# Altium schematic sheet Ethernet.SchDoc
size A4; SheetNumber: 7; SheetTotal: 12
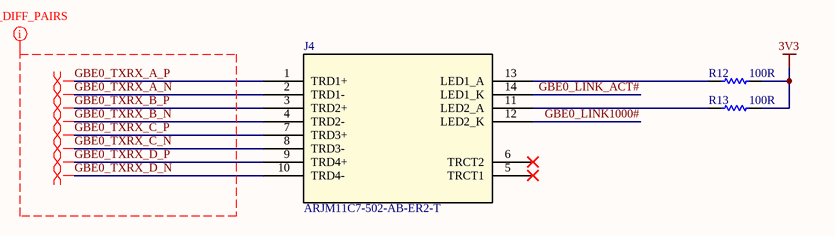
[diagram p0: Ethernet.SchDoc]

## Parts
J4  ARJM11C7-502-AB-ER2-T  [ARJM11C7-502-AB-ER2-T_ABR]
R12  100R  [RES-0603]
R13  100R  [RES-0603]

## Nets
3V3: R12.2 R13.2
GBE0_LINK1000#: J4.12(LED2_K)
GBE0_LINK_ACT#: J4.14(LED1_K)
GBE0_TXRX_A_N: J4.2(TRD1-)
GBE0_TXRX_A_P: J4.1(TRD1+)
GBE0_TXRX_B_N: J4.4(TRD2-)
GBE0_TXRX_B_P: J4.3(TRD2+)
GBE0_TXRX_C_N: J4.8(TRD3-)
GBE0_TXRX_C_P: J4.7(TRD3+)
GBE0_TXRX_D_N: J4.10(TRD4-)
GBE0_TXRX_D_P: J4.9(TRD4+)
NetJ4_11: J4.11(LED2_A) R13.1
NetJ4_13: J4.13(LED1_A) R12.1

Not connected (* = marked no-connect by the designer): J4 5(TRCT1)* 6(TRCT2)*

## Layout directives
differential pair: GBE0_TXRX_A_N, GBE0_TXRX_A_P, GBE0_TXRX_B_N, GBE0_TXRX_B_P, GBE0_TXRX_C_N, GBE0_TXRX_C_P, GBE0_TXRX_D_N, GBE0_TXRX_D_P
net class ETH_DIFF_PAIRS: GBE0_TXRX_A_N, GBE0_TXRX_A_P, GBE0_TXRX_B_N, GBE0_TXRX_B_P, GBE0_TXRX_C_N, GBE0_TXRX_C_P, GBE0_TXRX_D_N, GBE0_TXRX_D_P

## Library data of the parts
J4 = ARJM11C7-502-AB-ER2-T: Ethernet connector with magnetics (1000-T Base); Manufacturer_Name: Abracon; Copyright: Copyright (C) 2025 Ultra Librarian. All rights reserved.; Manufacturer_Part_Number: ARJM11C7-502-AB-ER2-T; RefDes: RefDes; Type: Type
R12 R13 = RES-0603: Resistor chip. 0603